# EAGLE design MRCS-8xDPDT-Relay v1_2 (EAGLE 7.7.0)
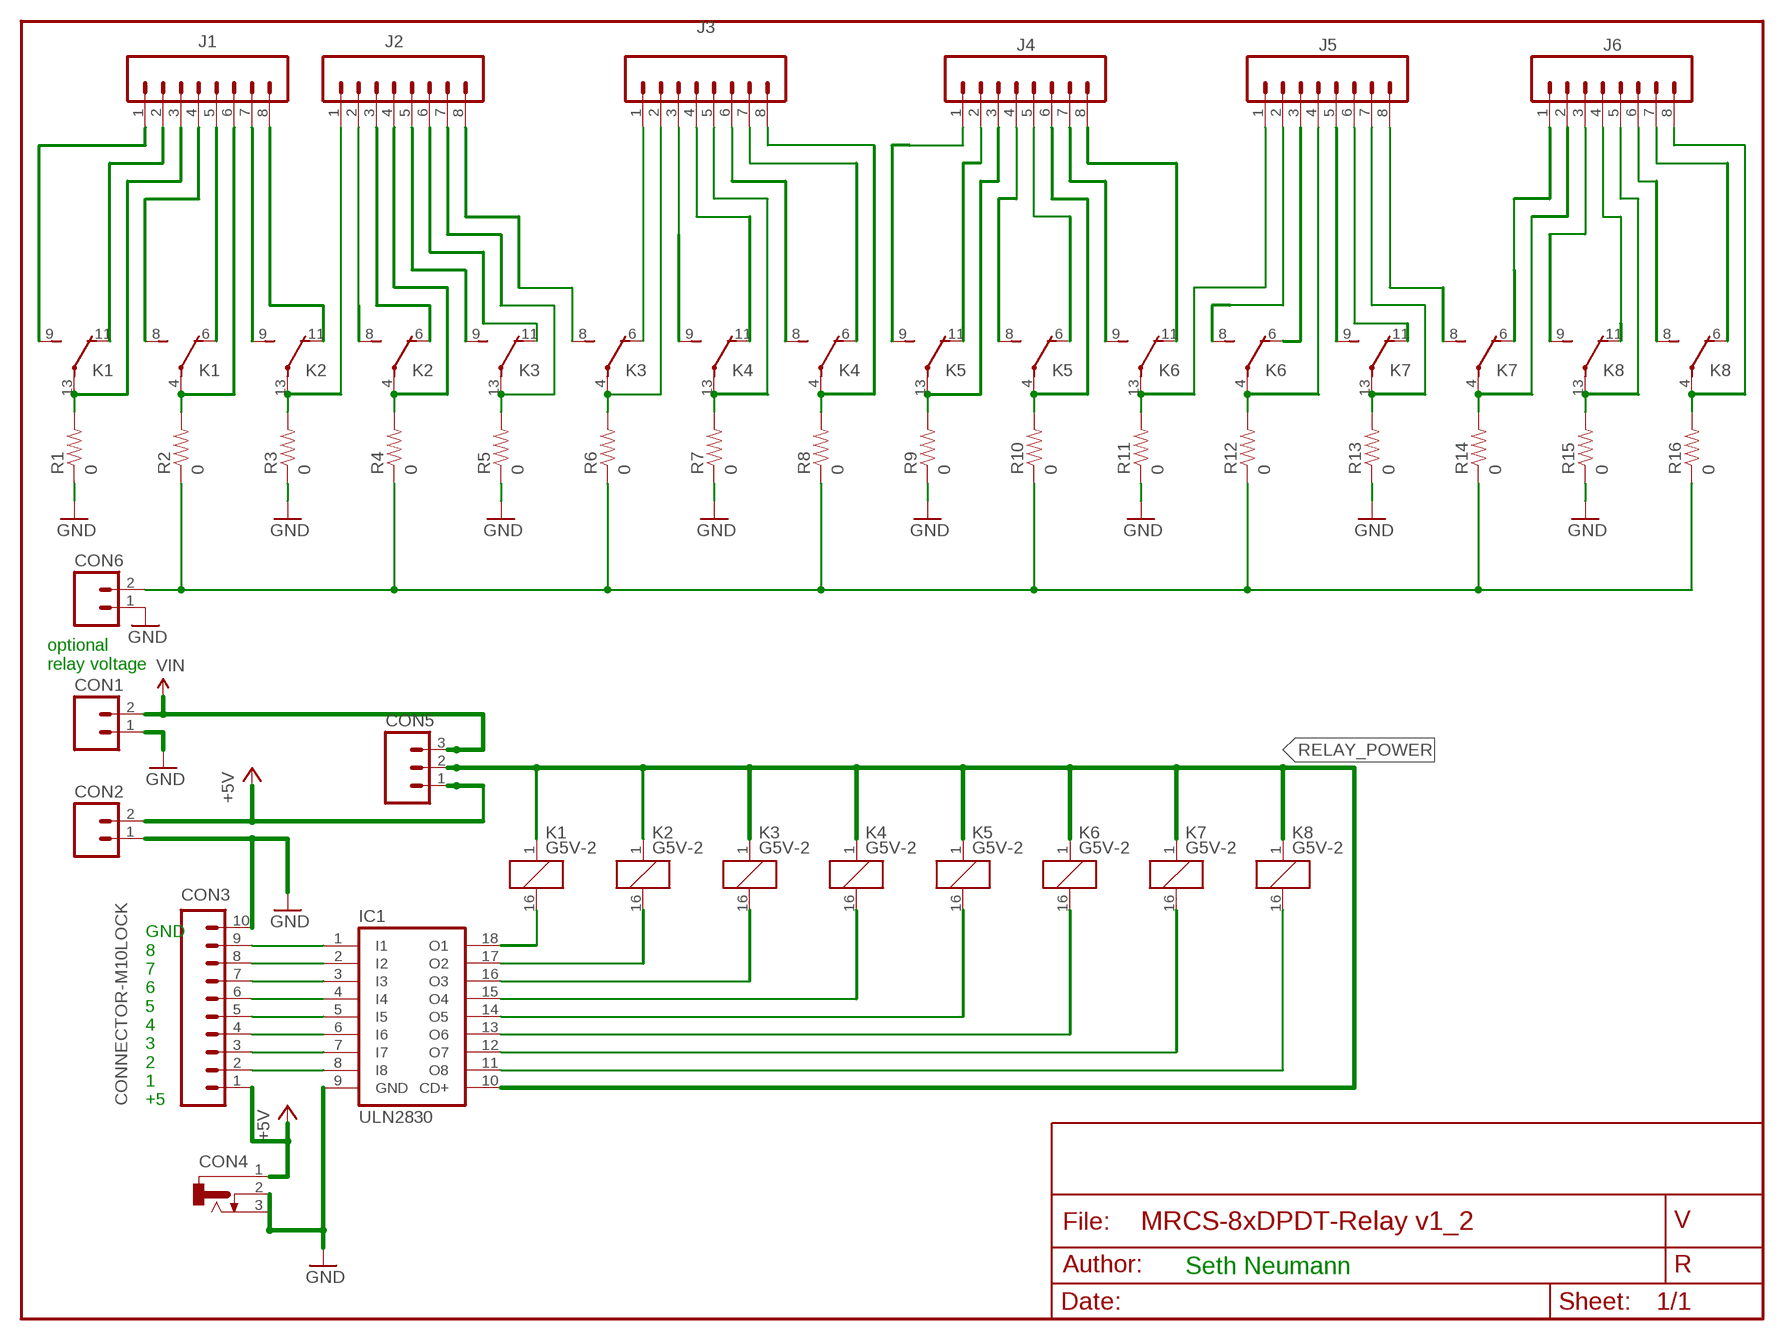
[diagram p0: schematic, sheet 1]

## Parts
CON1  CONNECTOR-M023.5MM-LOCK  [SCREWTERMINAL-3.5MM-2_LOCK]
CON2  CONNECTOR-M023.5MM-LOCK  [SCREWTERMINAL-3.5MM-2_LOCK]
CON3  CONNECTOR-M10LOCK  [1X10_LOCK]
CON4  CONNECTOR-DC-POWER-RA  [DCJ0202]
CON5  CONNECTOR-M03MOLEX-254-LOCK  [MOLEX-1X3_LOCK]
CON6  CONNECTOR-M023.5MM-LOCK  [SCREWTERMINAL-3.5MM-2_LOCK]
IC1  ULN2830  ULN2803A  [DIL18]
J1  CONNECTOR-M08LOCK  [1X08_LOCK]
J2  CONNECTOR-M08LOCK  [1X08_LOCK]
J3  CONNECTOR-M08LOCK  [1X08_LOCK]
J4  CONNECTOR-M08LOCK  [1X08_LOCK]
J5  CONNECTOR-M08LOCK  [1X08_LOCK]
J6  CONNECTOR-M08LOCK  [1X08_LOCK]
K1  G5V-2  [G5V-2]
K2  G5V-2  [G5V-2]
K3  G5V-2  [G5V-2]
K4  G5V-2  [G5V-2]
K5  G5V-2  [G5V-2]
K6  G5V-2  [G5V-2]
K7  G5V-2  [G5V-2]
K8  G5V-2  [G5V-2]
R1  0  RPTH-R0  [CUT-R]
R2  0  RPTH-R0  [CUT-R]
R3  0  RPTH-R0  [CUT-R]
R4  0  RPTH-R0  [CUT-R]
R5  0  RPTH-R0  [CUT-R]
R6  0  RPTH-R0  [CUT-R]
R7  0  RPTH-R0  [CUT-R]
R8  0  RPTH-R0  [CUT-R]
R9  0  RPTH-R0  [CUT-R]
R10  0  RPTH-R0  [CUT-R]
R11  0  RPTH-R0  [CUT-R]
R12  0  RPTH-R0  [CUT-R]
R13  0  RPTH-R0  [CUT-R]
R14  0  RPTH-R0  [CUT-R]
R15  0  RPTH-R0  [CUT-R]
R16  0  RPTH-R0  [CUT-R]

## Nets
+5V: CON2.2(B) CON3.1 CON4.1 CON5.1
AUX_COMMON: CON6.2(B) R2.P2 R4.P2 R6.P2 R8.P2 R10.P2 R12.P2 R14.P2 R16.P2
GND: CON1.1(A) CON2.1(A) CON3.10 CON4.2 CON4.3 CON6.1(A) IC1.9(GND) R1.P2 R3.P2 R5.P2 R7.P2 R9.P2 R11.P2 R13.P2 R15.P2
N$1: CON3.9 IC1.1(I1)
N$2: CON3.8 IC1.2(I2)
N$3: CON3.7 IC1.3(I3)
N$4: CON3.6 IC1.4(I4)
N$5: CON3.5 IC1.5(I5)
N$6: CON3.4 IC1.6(I6)
N$7: CON3.3 IC1.7(I7)
N$8: CON3.2 IC1.8(I8)
N$9: IC1.17(O2) K2.16
N$10: IC1.16(O3) K3.16
N$11: IC1.15(O4) K4.16
N$12: IC1.14(O5) K5.16
N$13: J1.7 K2.9(2:S)
N$14: IC1.13(O6) K6.16
N$15: IC1.12(O7) K7.16
N$16: IC1.11(O8) K8.16
N$18: J1.1 K1.9(2:S)
N$19: J1.2 K1.11(2:O)
N$20: J1.3 K1.13(2:P) R1.P1
N$21: J1.4 K1.8(1:S)
N$22: IC1.18(O1) K1.16
N$23: J1.5 K1.6(1:O)
N$24: J1.6 K1.4(1:P) R2.P1
N$25: J1.8 K2.11(2:O)
N$26: J2.1 K2.13(2:P) R3.P1
N$27: J2.2 K2.8(1:S)
N$28: J4.3 K5.13(2:P) R9.P1
N$29: J2.4 K2.4(1:P) R4.P1
N$30: J2.7 K3.13(2:P) R5.P1
N$31: J2.6 K3.11(2:O)
N$32: J2.8 K3.8(1:S)
N$33: J2.5 K3.9(2:S)
N$34: J3.1 K3.6(1:O)
N$35: J3.2 K3.4(1:P) R6.P1
N$36: J3.3 K4.9(2:S)
N$37: J3.4 K4.11(2:O)
N$38: J3.5 K4.13(2:P) R7.P1
N$39: J3.6 K4.8(1:S)
N$40: J3.7 K4.6(1:O)
N$41: J3.8 K4.4(1:P) R8.P1
N$42: J5.4 K6.4(1:P) R12.P1
N$43: J5.5 K7.9(2:S)
N$44: J5.6 K7.11(2:O)
N$45: J5.7 K7.13(2:P) R13.P1
N$46: J5.8 K7.8(1:S)
N$47: J6.1 K7.6(1:O)
N$48: J6.2 K7.4(1:P) R14.P1
N$49: J6.3 K8.9(2:S)
N$50: J6.4 K8.11(2:O)
N$51: J6.5 K8.13(2:P) R15.P1
N$52: J6.6 K8.8(1:S)
N$53: J6.7 K8.6(1:O)
N$54: J6.8 K8.4(1:P) R16.P1
N$55: J5.3 K6.6(1:O)
N$56: J5.2 K6.8(1:S)
N$57: J5.1 K6.13(2:P) R11.P1
N$59: J4.7 K6.9(2:S)
N$60: J4.6 K5.4(1:P) R10.P1
N$61: J4.5 K5.6(1:O)
N$62: J4.4 K5.8(1:S)
N$63: J2.3 K2.6(1:O)
N$64: J4.2 K5.11(2:O)
N$65: J4.1 K5.9(2:S)
N$66: J4.8 K6.11(2:O)
RELAY_POWER: CON5.2 IC1.10(CD+) K1.1 K2.1 K3.1 K4.1 K5.1 K6.1 K7.1 K8.1
VIN: CON1.2(B) CON5.3

## Notes on the sheet
- optional 
  relay voltage
- GND
  8
  7
  6
  5
  4
  3
  2
  1
  +5
- Seth Neumann

## Library data of the parts
CON1 CON2 CON6 = SPCoast:CONNECTOR-M02: PHOENIX CONNECTOR
CON3 = SPCoast:CONNECTOR-M10: Header 10 Standard 10-pin 0.1" header. Use with straight break away headers (SKU : PRT-00116), right angle break away headers (PRT-00553), swiss pins (PRT-00743), machine pins (PRT-00117), and female headers (PRT-00115).
CON4 = SPCoast:CONNECTOR-DC-POWER: DC POWER JACK
CON5 = SPCoast:CONNECTOR-M03
IC1 = MRCS:ULN2803A: DRIVER ARRAY
J1-J6 = SPCoast:CONNECTOR-M08: Header 8 Standard 8-pin 0.1" header. Use with straight break away headers (SKU : PRT-00116), right angle break away headers (PRT-00553), swiss pins (PRT-00743), machine pins (PRT-00117), and female headers (PRT-00115).
K1-K8 = relay:G5V-2: OMRON PCB Relay Source: http://www.omron.com/ecb/products/pdf/en-g5v2.pdf; MPN: G5V-2 5DC; OC_FARNELL: 9949488; OC_NEWARK: 78K5703
R1-R16 = SPCoast:R*: Resistor Basic schematic elements and footprints for 0603, 1206, and PTH 1/10th watt (small) resistors.

## Board
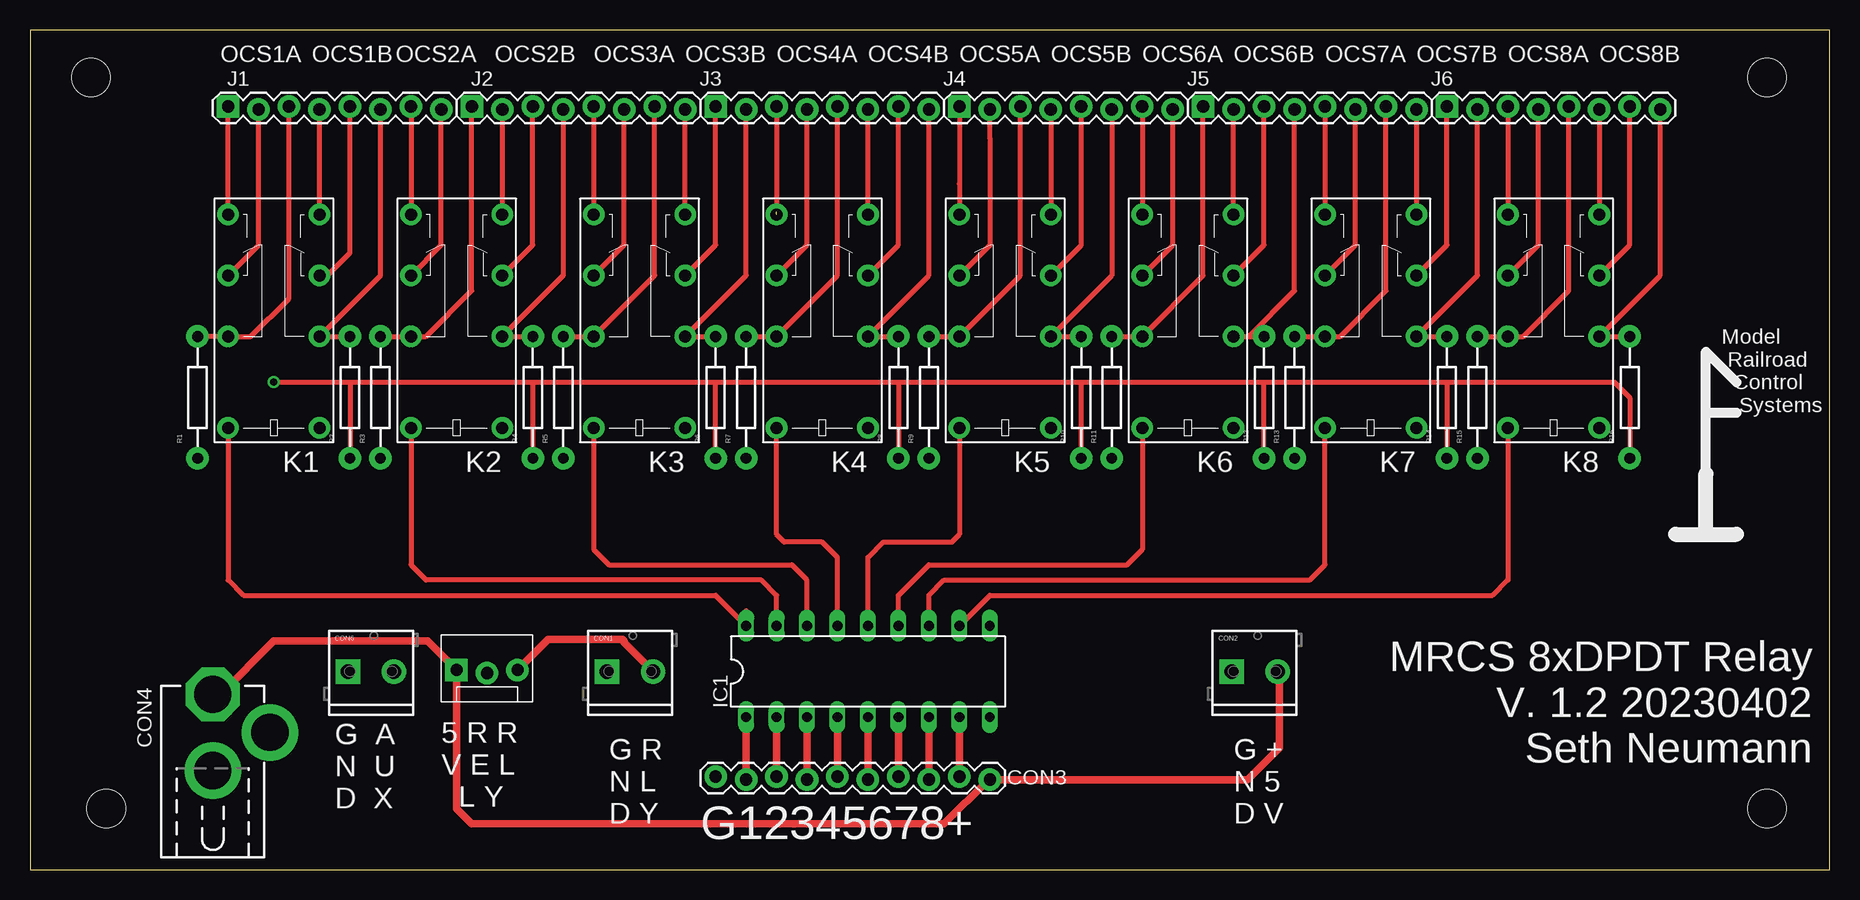
[diagram p1: board, top side]
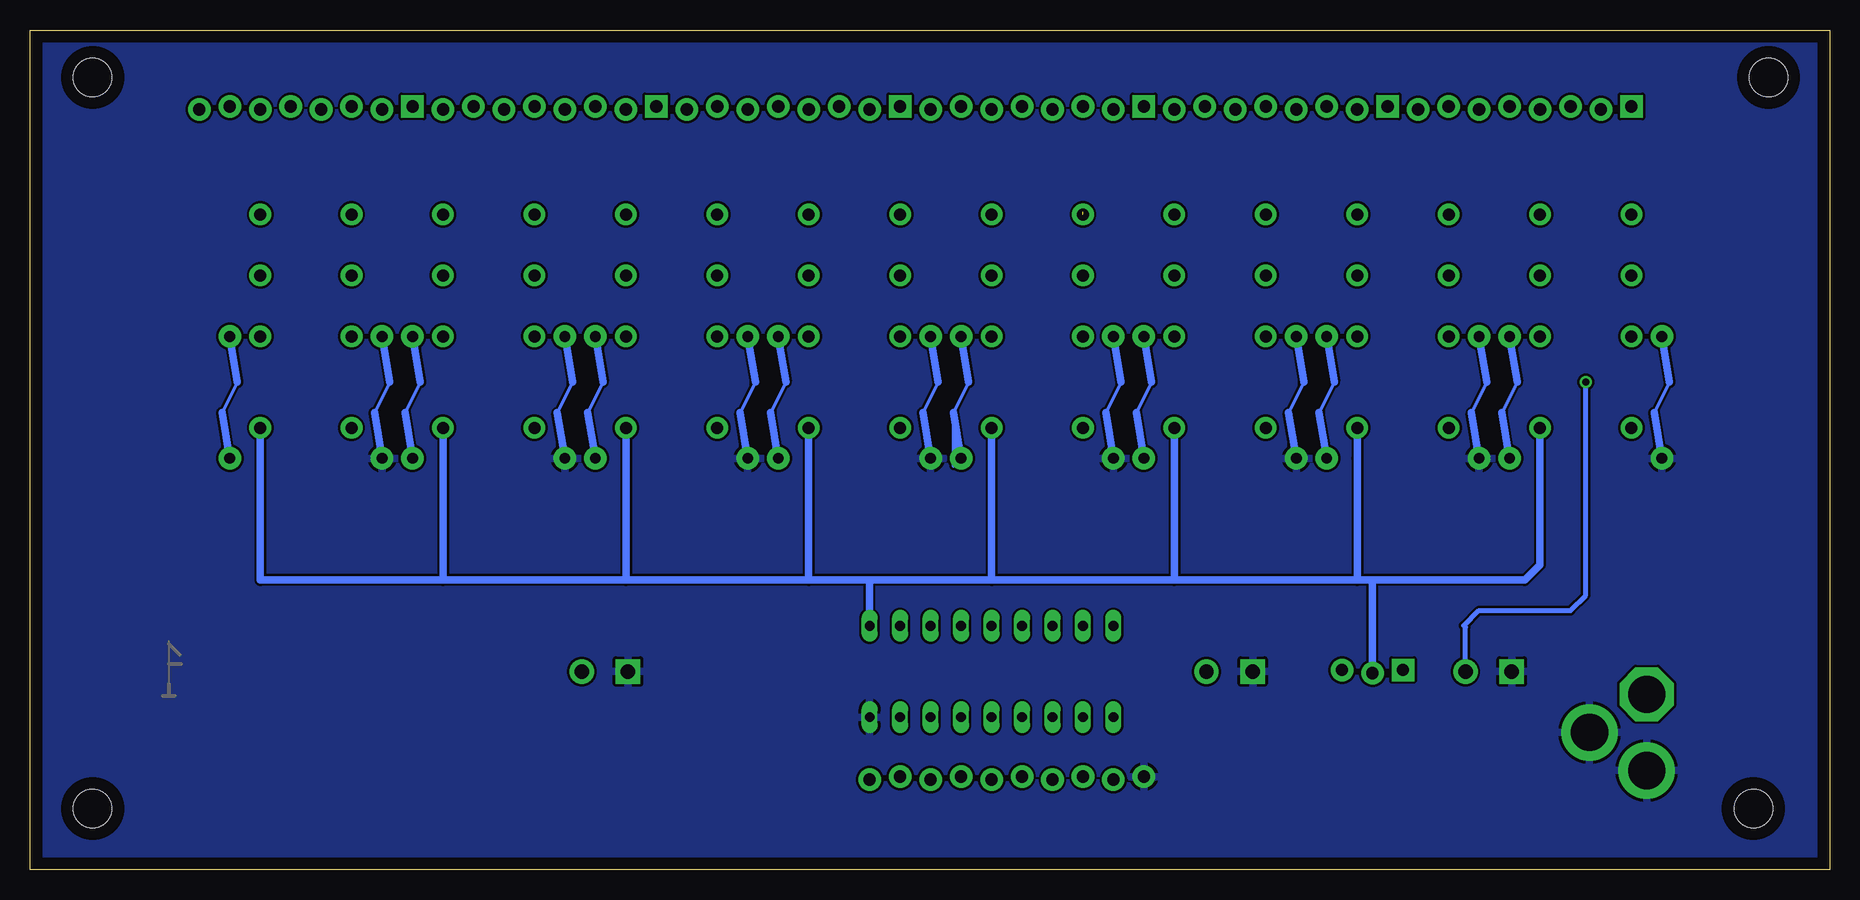
[diagram p2: board, bottom side, seen from below]

Size 150 x 70 mm. Coordinates in mm from the lower left corner, seen from the top.
Outline: 0,0 150,0 150,70 0,70 0,0
Copper layers (1*16): Top 0.035mm / dielectric 1.5mm / Bottom 0.035mm
Design rules "default": minimum track width 10mil, minimum drill 24mil, track to track 8mil, track to pad 8mil, pad to pad 8mil, via to via 8mil, smd to smd 8mil, copper to edge 40mil, drill to drill 8mil, minimum pad ring 10mil, minimum via ring 8mil, stop-mask expansion 4mil, vias tented up to drill 0mil, thermal gap 10mil
Holes 3.2 mm at 5.08,66.04 6.35,5.08 144.78,5.08 144.78,66.04

### Footprints (pad centres in the part's own frame; a part is rotated, then mirrored left to right if it is on the bottom)
SCREWTERMINAL-3.5MM-2_LOCK = drill 1.2 pad 2.032 square: 1 -0.178,0 | drill 1.2 pad 2.032: 2 3.678,0
1X10_LOCK = drill 1.016 pad 1.88: 1 0,0.127; 2 2.54,-0.127; 3 5.08,0.127; 4 7.62,-0.127; 5 10.16,0.127; 6 12.7,-0.127; 7 15.24,0.127; 8 17.78,-0.127; 9 20.32,0.127; 10 22.86,-0.127
DCJ0202 = drill 3.1 pad 4.5 octagon: 1 0,3.175 | drill 3.1 pad 4.7: 2 4.763,0; 3 0,-3.175
MOLEX-1X3_LOCK = drill 1.016 pad 1.88 square: 1 0,0.127 | drill 1.016 pad 1.88: 2 2.54,-0.127; 3 5.08,0.127
DIL18 = drill 0.813 long: 1 -10.16,-3.81; 2 -7.62,-3.81; 3 -5.08,-3.81; 4 -2.54,-3.81; 5 0,-3.81; 6 2.54,-3.81; 7 5.08,-3.81; 8 7.62,-3.81; 9 10.16,-3.81; 10 10.16,3.81; 11 7.62,3.81; 12 5.08,3.81; 13 2.54,3.81; 14 0,3.81; 15 -2.54,3.81; 16 -5.08,3.81; 17 -7.62,3.81; 18 -10.16,3.81
1X08_LOCK = drill 1.016 pad 1.88 square: 1 0,0.127 | drill 1.016 pad 1.88: 2 2.54,-0.127; 3 5.08,0.127; 4 7.62,-0.127; 5 10.16,0.127; 6 12.7,-0.127; 7 15.24,0.127; 8 17.78,-0.127
G5V-2 = drill 1 pad 1.8: 1 -8.89,-3.81; 4 -1.27,-3.81; 6 3.81,-3.81; 8 8.89,-3.81; 9 8.89,3.81; 11 3.81,3.81; 13 -1.27,3.81; 16 -8.89,3.81
CUT-R = drill 0.9 pad 1.88: P1 5.08,0; P2 -5.08,0

### Placement (x,y rotation side)
CON1  48.26,16.51 0 top
CON2  100.33,16.51 0 top
CON3  80.01,7.62 180 top
CON4  15.24,11.43 0 top
CON5  35.56,16.51 0 top
CON6  26.67,16.51 0 top
IC1  69.85,16.51 0 top
J1  16.51,63.5 0 top
J2  36.83,63.5 0 top
J3  57.15,63.5 0 top
J4  77.47,63.5 0 top
J5  97.79,63.5 0 top
J6  118.11,63.5 0 top
K1  20.32,45.72 90 top
K2  35.56,45.72 90 top
K3  50.8,45.72 90 top
K4  66.04,45.72 90 top
K5  81.28,45.72 90 top
K6  96.52,45.72 90 top
K7  111.76,45.72 90 top
K8  127,45.72 90 top
R1  13.97,39.37 90 top
R2  26.67,39.37 90 top
R3  29.21,39.37 90 top
R4  41.91,39.37 90 top
R5  44.45,39.37 90 top
R6  57.15,39.37 90 top
R7  59.69,39.37 90 top
R8  72.39,39.37 90 top
R9  74.93,39.37 90 top
R10  87.63,39.37 90 top
R11  90.17,39.37 90 top
R12  102.87,39.37 90 top
R13  105.41,39.37 90 top
R14  118.11,39.37 90 top
R15  120.65,39.37 90 top
R16  133.35,39.37 90 top
U$1  [CA-PROP65WARNING]  109.22,8.89 0 top
U$2  [MRCSLOGOBTM]  132.08,13.97 0 top
U$4  [MRCS-LOGO-LARGE]  139.7,34.29 0 top

### Tracks (layer width: path | path; a pad name or v marks a point on that pad's centre or on a via)
+5V
  Top 0.61: CON4.1 15.88,14.61 20.32,19.05 33.15,19.05 CON5.1 35.56,5.08 36.83,3.81 76.2,3.81 79.88,7.49 CON3.1 101.47,7.49 104.14,10.16 104.14,16.38 CON2.2
AUX_COMMON  (via drill 0.6)
  Top 0.406: v20.32,40.64 26.67,40.64 | 26.67,40.64 41.91,40.64 | 41.91,40.64 57.15,40.64 | 57.15,40.64 72.39,40.64 | 72.39,40.64 87.63,40.64 | 87.63,40.64 102.87,40.64 | 102.87,40.64 118.11,40.64 | 118.11,40.64 R14.P2 | 26.67,40.64 R2.P2 | 41.91,40.64 R4.P2 | R6.P2 57.15,40.64 | 72.39,40.64 R8.P2 | R10.P2 87.63,40.64 | R12.P2 102.87,40.64 | 118.11,40.64 132.08,40.64 133.35,39.37 R16.P2
  Bottom 0.305: 30.35,20.19 30.48,20.32 | 73.03,38.1 73.03,33.66 R8.P2
  Bottom 0.406: CON6.2 30.35,20.19 | 30.48,20.32 29.21,21.59 21.59,21.59 20.32,22.86 v20.32,40.64
GND
  pour Bottom: 0,0 149.86,0 149.86,69.85 0,69.85
  pour Bottom (isolate 0.254): 0,0 149.86,0 149.86,69.85 0,69.85
N$1
  Top 0.61: IC1.1 CON3.9
N$2
  Top 0.61: IC1.2 CON3.8
N$3
  Top 0.61: IC1.3 CON3.7
N$4
  Top 0.61: IC1.4 CON3.6
N$5
  Top 0.61: IC1.5 CON3.5
N$6
  Top 0.61: IC1.6 CON3.4
N$7
  Top 0.61: IC1.7 CON3.3
N$8
  Top 0.61: IC1.8 CON3.2
N$9
  Top 0.406: IC1.17 62.23,22.86 60.96,24.13 33.02,24.13 31.75,25.4 K2.16
N$10
  Top 0.406: IC1.16 64.77,24.13 63.5,25.4 48.26,25.4 46.99,26.67 K3.16
N$11
  Top 0.406: IC1.15 67.31,26.04 66.04,27.3 62.87,27.3 62.23,27.94 K4.16
N$12
  Top 0.406: IC1.14 69.85,26.04 71.12,27.3 76.83,27.3 77.47,27.94 K5.16
N$13
  Top 0.406: J1.7 K2.9
N$14
  Top 0.406: IC1.13 72.39,22.86 74.93,25.4 91.44,25.4 92.71,26.67 K6.16
N$15
  Top 0.406: IC1.12 74.93,22.86 76.2,24.13 106.68,24.13 107.95,25.4 K7.16
N$16
  Top 0.406: IC1.11 80.01,22.86 121.92,22.86 123.19,24.13 K8.16
N$18
  Top 0.406: K1.9 J1.1
N$19
  Top 0.406: K1.11 19.05,52.07 J1.2
N$20
  Top 0.406: J1.3 21.59,47.62 18.41,44.45 K1.13 R1.P1
N$21
  Top 0.406: K1.8 J1.4
N$22
  Top 0.406: 59.69,21.59 IC1.18 57.15,22.86 17.78,22.86 16.51,24.13 K1.16
N$23
  Top 0.406: K1.6 24.77,49.53 26.67,51.44 J1.5
N$24
  Top 0.406: J1.6 29.21,49.53 K1.4 R2.P1
N$25
  Top 0.406: K2.11 34.29,52.07 J1.8
N$26
  Top 0.406: J2.1 36.83,48.26 33.02,44.45 32.38,44.45 K2.13 R3.P1
N$27
  Top 0.406: J2.2 K2.8
N$28
  Top 0.406: J4.3 82.55,49.53 K5.13 R9.P1
N$29
  Top 0.406: J2.4 44.45,49.53 K2.4 R4.P1
N$30
  Top 0.406: J2.7 52.07,49.53 K3.13 R5.P1
N$31
  Top 0.406: K3.11 49.53,52.07 J2.6
N$32
  Top 0.406: K3.8 J2.8
N$33
  Top 0.406: J2.5 K3.9
N$34
  Top 0.406: K3.6 57.15,52.07 J3.1
N$35
  Top 0.406: J3.2 59.69,49.53 K3.4 R6.P1
N$36  (1 unrouted)
  Top 0.406: J3.3 62.23,54.84
N$37
  Top 0.406: K4.11 64.77,52.07 J3.4
N$38
  Top 0.406: J3.5 67.31,49.53 K4.13 R7.P1
N$39
  Top 0.406: K4.8 J3.6
N$40
  Top 0.406: K4.6 72.39,52.07 J3.7
N$41
  Top 0.406: J3.8 74.93,49.53 K4.4 R8.P1
N$42
  Top 0.406: K6.4 101.6,44.45 | 101.6,44.45 105.41,48.26 J5.4 | 101.6,44.45 R12.P1
N$43
  Top 0.406: J5.5 K7.9
N$44
  Top 0.406: K7.11 110.49,52.07 J5.6
N$45
  Top 0.406: J5.7 113.03,48.26 109.22,44.45 K7.13 R13.P1
N$46
  Top 0.406: J5.8 K7.8
N$47
  Top 0.406: K7.6 118.11,52.07 J6.1
N$48
  Top 0.406: J6.2 120.65,49.53 K7.4 R14.P1
N$49
  Top 0.406: J6.3 K8.9
N$50
  Top 0.406: K8.11 125.73,52.07 J6.4
N$51
  Top 0.406: J6.5 128.27,48.26 124.46,44.45 123.83,44.45 K8.13 R15.P1
N$52
  Top 0.406: J6.6 K8.8
N$53
  Top 0.406: K8.6 133.35,52.07 J6.7
N$54
  Top 0.406: J6.8 135.89,49.53 K8.4 R16.P1
N$55
  Top 0.406: K6.6 102.87,52.07 J5.3
N$56
  Top 0.406: K6.8 J5.2
N$57
  Top 0.406: J5.1 97.79,49.53 K6.13 R11.P1
N$59
  Top 0.406: J4.7 K6.9
N$60
  Top 0.406: J4.6 90.17,49.53 K5.4 R10.P1
N$61
  Top 0.406: K5.6 87.63,52.07 J4.5
N$62
  Top 0.406: J4.4 K5.8
N$63
  Top 0.406: K2.6 41.91,52.07 J2.3
N$64
  Top 0.406: J4.2 80.01,60.96 80.01,52.07 K5.11
N$65
  Top 0.406: J4.1 77.47,57.15 K5.9
N$66
  Top 0.406: K6.11 95.25,52.07 J4.8
RELAY_POWER
  Bottom 0.61: 38.1,24.13 25.4,24.13 24.13,25.4 24.13,34.29 K1.1 | 38.1,24.13 39.37,24.13 | 39.37,24.13 54.61,24.13 | 54.61,24.13 69.85,24.13 | 69.85,24.13 80.01,24.13 | 80.01,24.13 85.09,24.13 | 85.09,24.13 100.33,24.13 | 100.33,24.13 115.57,24.13 | 115.57,24.13 130.81,24.13 K8.1 | IC1.10 80.01,24.13 | CON5.2 38.1,24.13 | 39.37,24.13 39.37,34.29 K2.1 | K3.1 54.61,24.13 | K4.1 69.85,24.13 | K5.1 85.09,24.13 | K6.1 100.33,24.13 | K7.1 115.57,24.13
VIN
  Top 0.61: CON5.3 43.18,19.18 49.4,19.18 49.53,19.05 49.53,18.92 CON1.2

### Text on the board
tPlace: OCS1A | OCS1B | OCS2A | OCS2B | OCS3A | OCS3B | OCS4A | OCS4B | OCS5A | OCS5B | OCS6A | OCS6B | OCS7A | OCS7B | OCS8A | OCS8B | MRCS 8xDPDT Relay / V. 1.2 20230402 / Seth Neumann | G A / N U / D X | G R / N L / D Y | G + / N 5 / D V | 5 R R / V E L / L Y | G12345678+